# Altium schematic sheet power.SchDoc
size A4
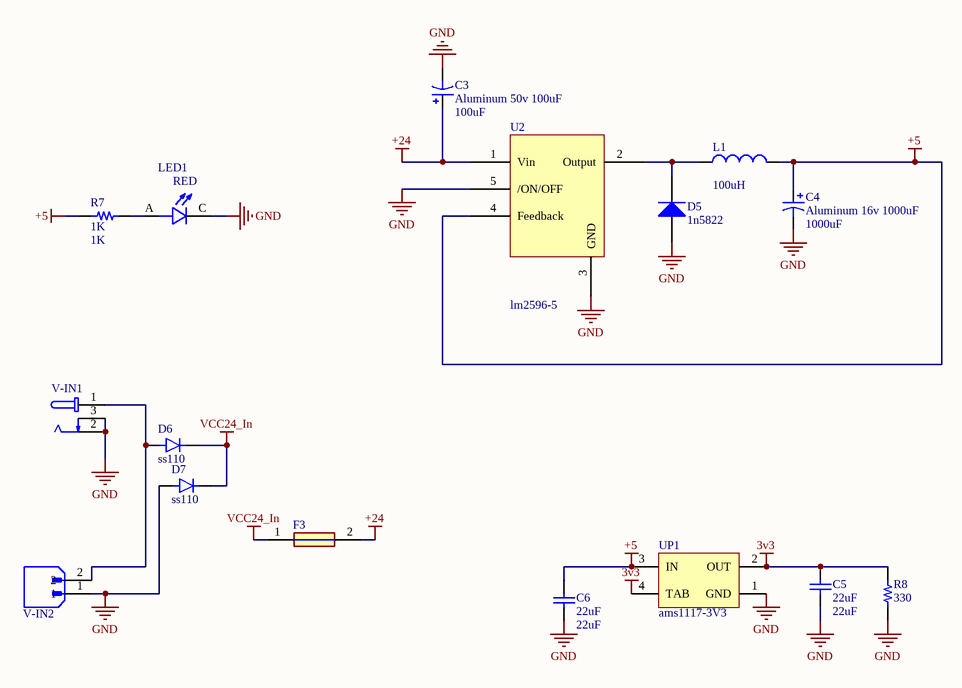
[diagram p0: power.SchDoc]

## Parts
C3  Aluminum 50v 100uF  value 100uF  [Cap SMD 100UF 35~50v]
C4  Aluminum 16v 1000uF  value 1000uF  [CAP SMD 1000UF 16V]
C5  22uF  [0603C]
C6  22uF  [0603C]
D5  1n5822  [SMA DIODE 2]
D6  ss110  [ss110]
D7  ss110  [ss110]
F3  fuse 2amp  [1206 FUSE]  (value not drawn)
L1  value 100uH  [inductor]  (hidden comment: inductor 100uH)
LED1  LED RED  [LED_7012X1]  (value not drawn)
R7  1K  [0603R]
R8  330  [0603R]
U2  lm2596-5  [2596]
UP1  ams1117-3V3  [SOT223]
V-IN1  DC jack power  [GCT_DCJ235-05-A-XX-X_REVA]  (value not drawn)
V-IN2  Phoenix  [AMPHENOL_OQ0271510000G]  (value not drawn)

## Nets
3v3: C5.2 R8.1 UP1.2(OUT) UP1.4(TAB)
+5: C4.1 C6.2 L1.2 R7.1 U2.4(Feedback) UP1.3(IN)
+24: C3.1 F3.2 U2.1(Vin)
GND: C3.2 C4.2 C5.1 C6.1 D5.1(A) D7.A LED1.C R8.2 U2.3(GND) U2.5(/ON/OFF) UP1.1(GND) V-IN1.2 V-IN1.3 V-IN2.1
VCC24_In: D6.C(K) D7.C(K) F3.1
NetD5_2: D5.2(K) L1.1 U2.2(Output)
NetD6_A: D6.A V-IN1.1 V-IN2.2
NetLED1_A: LED1.A R7.2

## Notes on the sheet
- (in symbol 7012X1) RED

## Library data of the parts
C3 C4 = Cap Pol1: CAP POLAR SMD; Published: 8-Jun-2000; LatestRevisionDate: 17-Jul-2002; LatestRevisionNote: Re-released for DXP Platform.; PackageReference: RB7.6-15; Publisher: Altium Limited; PackageDescription: Polarized Capacitor (Radial); 2 Leads
C5 C6 = Cap: CAP SMD 0603; Published: 8-Jun-2000; LatestRevisionDate: 17-Jul-2002; LatestRevisionNote: Re-released for DXP Platform.; PackageReference: RAD-0.3; Publisher: Altium Limited; PackageDescription: Radial Cap, Thru-Hole; 2 Leads; 0.3 in Pin Spacing; Value: 22uF
D5 = Diode 1N4007: 1 Amp schottky Diode SMA; Published: 8-Jun-2000; LatestRevisionDate: 17-Jul-2002; LatestRevisionNote: Re-released for DXP Platform.; DatasheetVersion: 1998; PackageVersion: Aug-1999; PackageReference: DO-41; Publisher: Altium Limited; PackageDescription: Diode, Axial; Body 5.2 x 2.7 mm (LxDia. max), Lead Dia. 0.86 mm (max); Code_JEDEC: DO-204-AL; ComponentLink1Description: Manufacturer Link; ComponentLink1URL: http://www.fairchildsemi.com/; ComponentLink2Description: Datasheet; ComponentLink2URL: http://www.fairchildsemi.com/ds/1N%2F1N4001.pdf
D6 D7 = SBR0560S1-7: Diode Super Barrier 60V 500mA Surface Mount SOD-123; MF: Diodes Inc.; MP: SBR0560S1-7; Availability: Unavailable; SnapEDA_Link: https://www.snapeda.com/parts/SBR0560S1-7/Diodes%20Inc./view-part/491648/?ref=snap; Package: SOD-123 Diodes Inc.; Value: *; Price: None
F3 = 1206SFS200F_63-2: Fuse 1206; Manufacturer_Name: TE Connectivity; Manufacturer_Part_Number: 1206SFS200F/63-2; Datasheet Link: http://docs-emea.rs-online.com/webdocs/13b6/0900766b813b6e27.pdf; Height: 1.17mm
L1 = Inductor: Inductor 12*12mm SMD; Code_IEC: 1005; Published: 8-Jun-2000; LatestRevisionDate: 29-May-2009; LatestRevisionNote: IPC-7351 Footprint Added.; PackageReference: 0402-A; Publisher: Altium Limited; PackageDescription: Chip Inductor; Code_JEITA: 0402
LED1 = 7012X1: LED SMD 0805 RED; Package: None; Price: None; Value: *; MP: 7012X1; Availability: Unavailable
R7 R8 = Resistor: RES SMD 0603; Part Number: RCS0805100KFKEA
  R7: Value: 1K
  R8: Value: 330
U2 = lm2596
UP1 = AMS1117-x.x: 3.3 Volt, 800mA SOT-223; Designer: Ali Hafizi; Data: 16-12-2016
V-IN1 = DCJ235-05-A-XX-X_REVA: Dc Power Jack on-board; MF: Global Connector Technology; MP: DCJ235-05-A-K1-A; Price: None; Availability: Unavailable; Package: None; SnapEDA_Link: https://www.snapeda.com/parts/DCJ235-05-A-K1-A/Global%20Connector%20Technology/view-part/813042/?ref=snap; Value: *
V-IN2 = OQ0271510000G: Phoenix Terminal Right 2PIN; MF: Amphenol Anytek; MP: OQ0271510000G; Value: *; Check_prices: https://www.snapeda.com/parts/OQ0271510000G/Amphenol/view-part/4075971/?ref=eda; SnapEDA_Link: https://www.snapeda.com/parts/OQ0271510000G/Amphenol/view-part/4075971/?ref=snap; Price: None; Availability: Warning; Purchase-URL: https://pricing.snapeda.com/search/part/OQ0271510000G/?ref=eda; Package: None